# EAGLE design linesensor (EAGLE 6.5.0)
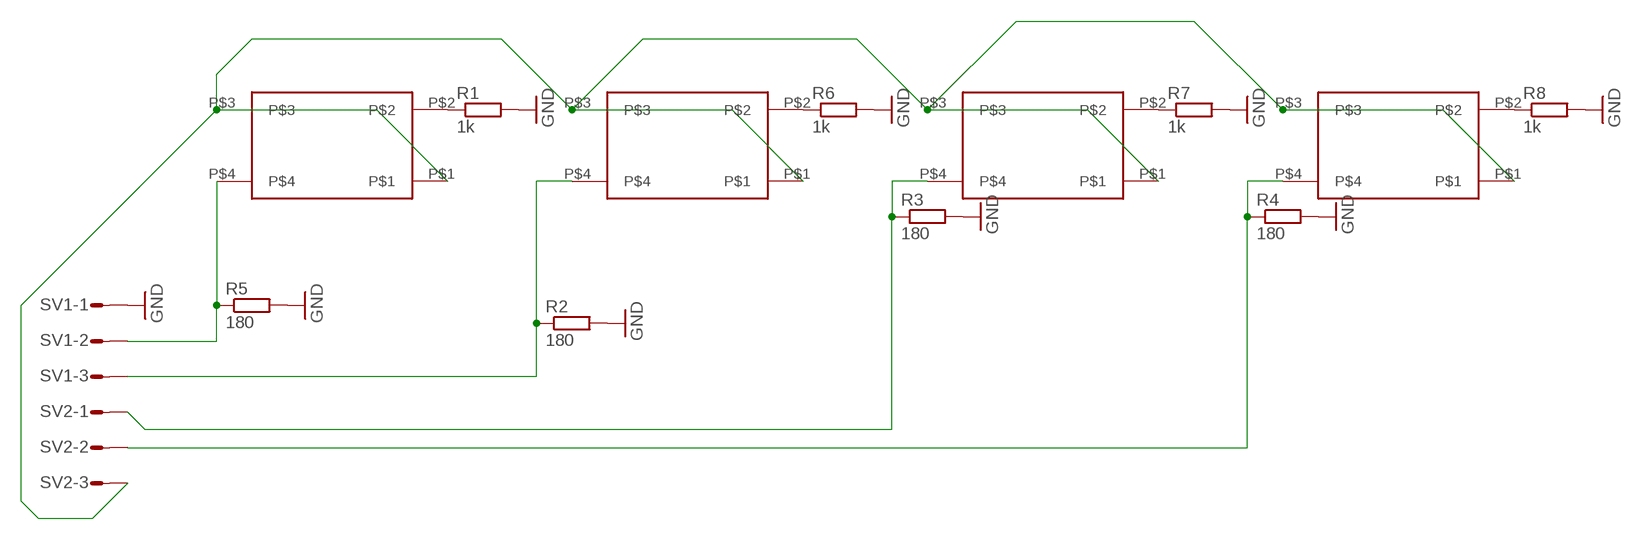
[diagram p0: schematic, sheet 1]

## Parts
R1  1k  R-EU_0204/2V  [0204V]
R2  180  R-EU_0204/2V  [0204V]
R3  180  R-EU_0204/2V  [0204V]
R4  180  R-EU_0204/2V  [0204V]
R5  180  R-EU_0204/2V  [0204V]
R6  1k  R-EU_0204/2V  [0204V]
R7  1k  R-EU_0204/2V  [0204V]
R8  1k  R-EU_0204/2V  [0204V]
SV1  S03P  [S03P]
SV2  S03P  [S03P]
U$1  TPR105F  [TPR105F]
U$2  TPR105F  [TPR105F]
U$3  TPR105F  [TPR105F]
U$4  TPR105F  [TPR105F]

## Nets
GND: R1.2 R2.2 R3.2 R4.2 R5.2 R6.2 R7.2 R8.2 SV1.1
N$1: SV2.3 U$1.P$1 U$1.P$3 U$2.P$1 U$2.P$3 U$3.P$1 U$3.P$3 U$4.P$1 U$4.P$3
N$3: R2.1 SV1.3 U$2.P$4
N$4: R3.1 SV2.1 U$3.P$4
N$5: R4.1 SV2.2 U$4.P$4
N$6: R1.1 U$1.P$2
N$7: R6.1 U$2.P$2
N$9: R5.1 SV1.2 U$1.P$4
N$10: R7.1 U$3.P$2
N$12: R8.1 U$4.P$2

## Library data of the parts
R1-R8 = rcl:R-EU_: RESISTOR, European symbol
SV1 SV2 = con-amp-mt:S03P: AMP MT CONNECTOR; OC_FARNELL: unknown; OC_NEWARK: unknown
U$1-U$4 = TPR105F:TPR105F

## Board
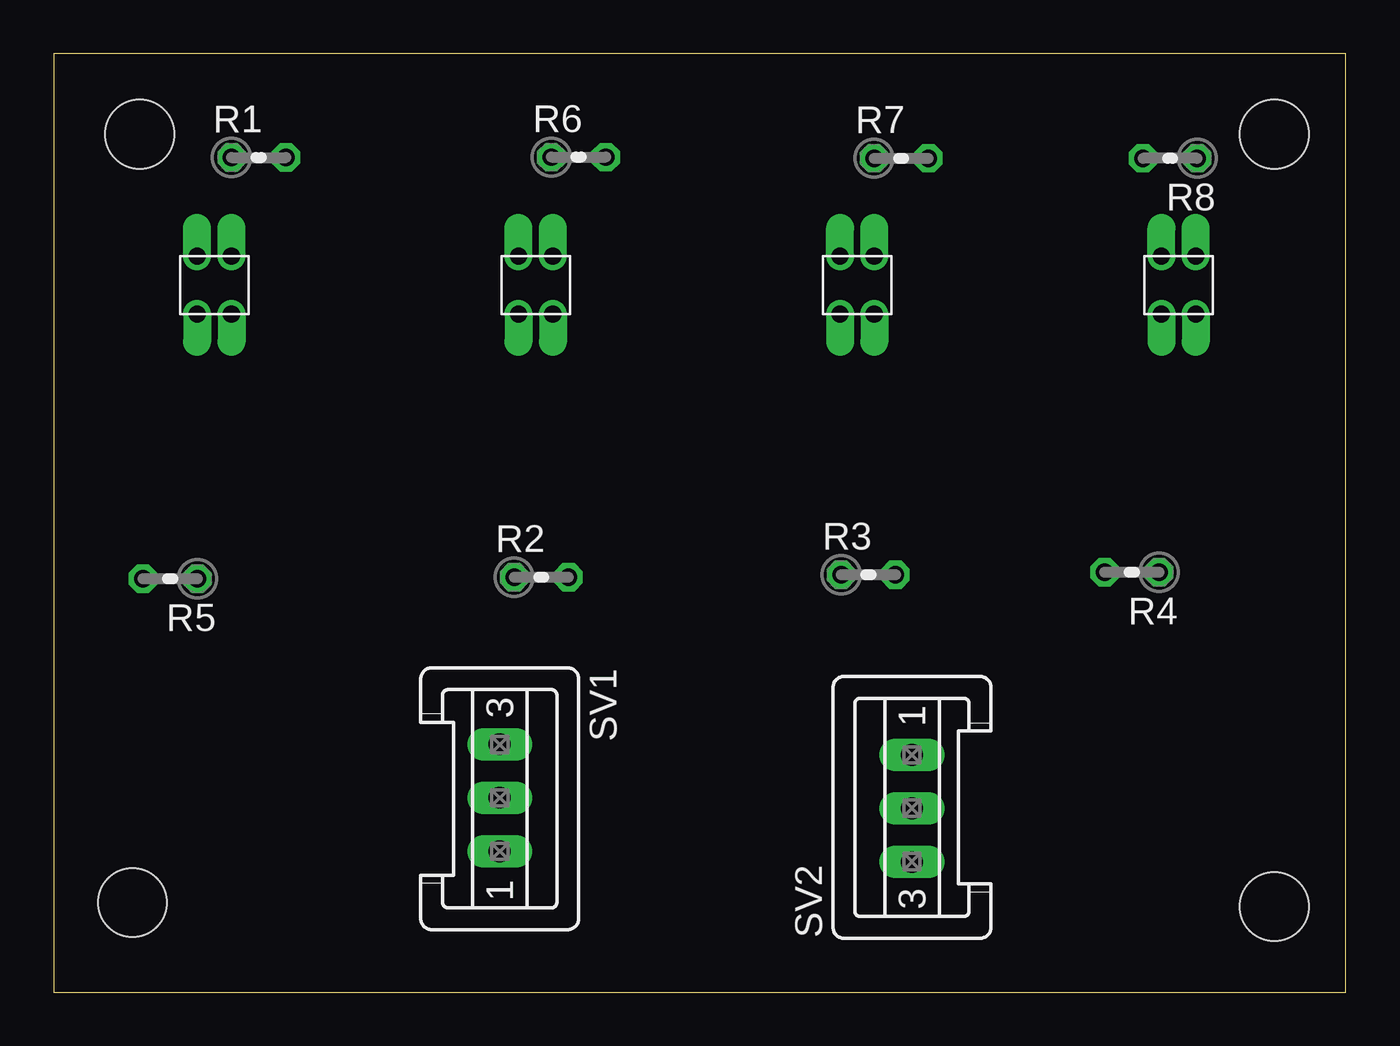
[diagram p1: board, top side]
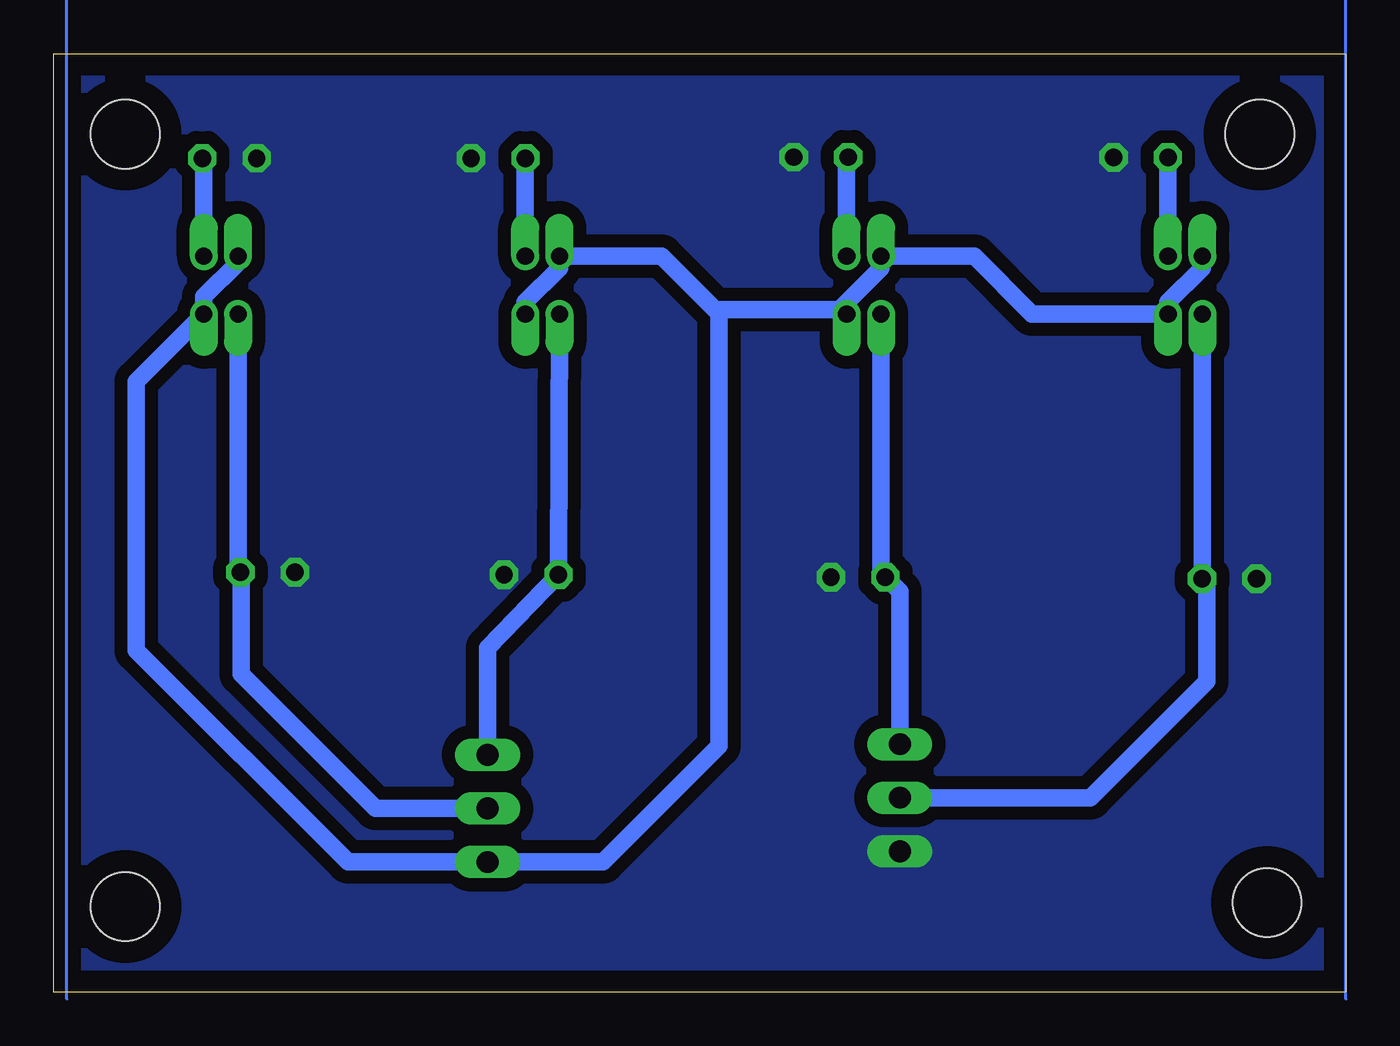
[diagram p2: board, bottom side, seen from below]

Size 60.31 x 43.8 mm. Coordinates in mm from the lower left corner, seen from the top.
Outline: 0,0 60.31,0 60.31,43.8 0,43.8 0,0
Copper layers (1*16): Top 0.035mm / dielectric 1.5mm / Bottom 0.035mm
Design rules "default": minimum track width 10mil, minimum drill 24mil, track to track 8mil, track to pad 8mil, pad to pad 8mil, via to via 8mil, smd to smd 8mil, copper to edge 40mil, drill to drill 8mil, minimum pad ring 10mil, minimum via ring 8mil, stop-mask expansion 4mil, vias tented up to drill 0mil, thermal gap 10mil
Holes 3.2 mm at 4.03,40.04 56.97,40.04 3.68,4.18 56.97,3.99

### Footprints (pad centres in the part's own frame; a part is rotated, then mirrored left to right if it is on the bottom)
0204V = drill 0.813 octagon: 1 -1.27,0; 2 1.27,0
S03P = drill 1.016 long: 1 2.5,0; 2 0,0; 3 -2.5,0
TPR105F = drill 0.8 offset: P$1 -0.8,1.35; P$2 -0.8,-1.35; P$3 0.8,-1.35; P$4 0.8,1.35

### Placement (x,y rotation side)
R1  9.58,38.95 0 top
R2  22.76,19.37 0 top
R3  38.02,19.48 0 top
R4  50.33,19.59 180 top
R5  5.44,19.29 180 top
R6  24.5,38.97 0 top
R7  39.56,38.92 0 top
R8  52.1,38.92 180 top
SV1  20.82,9.07 270 top
SV2  40.06,8.57 90 top
U$1  7.5,33 180 top
U$2  22.5,33 180 top
U$3  37.5,33 180 top
U$4  52.5,33 180 top

### Tracks (layer width: path | path; a pad name or v marks a point on that pad's centre or on a via)
GND
  pour Bottom (isolate 0.61, no thermals): 0,43.81 59.69,43.81 59.69,-0.32 0,-0.32
N$1
  Bottom 0.813: U$4.P$3 51.7,34.05 53.3,32.45 U$4.P$1 56.45,28.5 56.45,15.95 46.57,6.07 SV2.3 34.68,6.07 29.25,11.5 29.25,31.65 29.45,31.85 | U$3.P$1 38.3,32.2 36.7,33.8 U$3.P$3 31.95,34.35 29.45,31.85 | U$2.P$1 23.5,31.85 | 23.5,31.85 29.45,31.85 | 23.5,31.85 23.5,32 21.7,33.8 U$2.P$3 17.35,34.35 14.65,31.65 U$1.P$1 8.3,32.2 6.7,33.8 U$1.P$3
N$3
  Bottom 0.813: SV1.3 20.82,18.7 R2.1 21.7,19.57 U$2.P$4
N$4
  Bottom 0.813: SV2.1 40.06,16.06 R3.1 U$3.P$4
N$5
  Bottom 0.813: SV2.2 45.27,8.57 51.55,14.85 51.55,19.55 R4.1 51.7,19.7 U$4.P$4
N$6
  Bottom 0.813: U$1.P$2 R1.1
N$7
  Bottom 0.813: U$2.P$2 23.3,38.9 R6.1
N$9
  Bottom 0.813: SV1.2 11.93,9.07 6.5,14.5 6.5,19.08 R5.1 U$1.P$4
N$10
  Bottom 0.813: U$3.P$2 38.3,38.91 R7.1
N$12
  Bottom 0.813: U$4.P$2 53.3,38.84 R8.1
(copper drawn outside any net)
  shapes: Bottom area x1